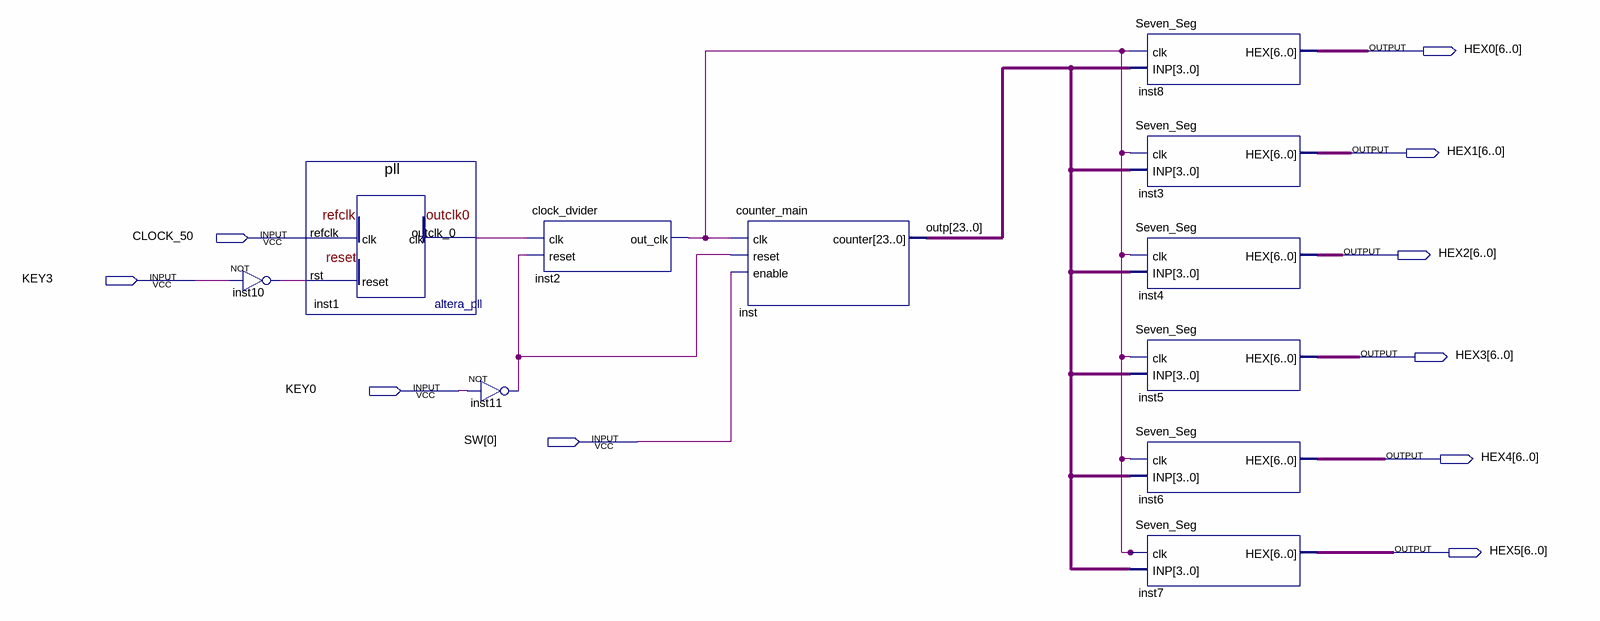
[diagram p0: schematic sheet]
// Quartus schematic my_fpga.bdf as structural Verilog: 11 symbols, 10 pins
module my_fpga (
  input  CLOCK_50,
  input  KEY3,
  input  KEY0,
  input  [0:0] SW,
  output [6:0] HEX0,
  output [6:0] HEX1,
  output [6:0] HEX2,
  output [6:0] HEX3,
  output [6:0] HEX4,
  output [6:0] HEX5
);

  wire inst1_outclk_0, inst2_out_clk, inst10_out, inst11_out;
  wire [23:0] outp;

  not inst10 (inst10_out, KEY3);
  pll inst1 (.refclk(CLOCK_50), .rst(inst10_out), .outclk_0(inst1_outclk_0));
  not inst11 (inst11_out, KEY0);
  clock_dvider inst2 (.clk(inst1_outclk_0), .reset(inst11_out), .out_clk(inst2_out_clk));
  counter_main inst (.clk(inst2_out_clk), .reset(inst11_out), .enable(SW[0]), .counter(outp));
  Seven_Seg inst8 (.clk(inst2_out_clk), .INP(outp), .HEX(HEX0));
  Seven_Seg inst3 (.clk(inst2_out_clk), .INP(outp), .HEX(HEX1));
  Seven_Seg inst4 (.clk(inst2_out_clk), .INP(outp), .HEX(HEX2));
  Seven_Seg inst5 (.clk(inst2_out_clk), .INP(outp), .HEX(HEX3));
  Seven_Seg inst6 (.clk(inst2_out_clk), .INP(outp), .HEX(HEX4));
  Seven_Seg inst7 (.clk(inst2_out_clk), .INP(outp), .HEX(HEX5));
endmodule
